# Altium schematic sheet DynamicComplexModulo_v1i1.SchDoc
size A3
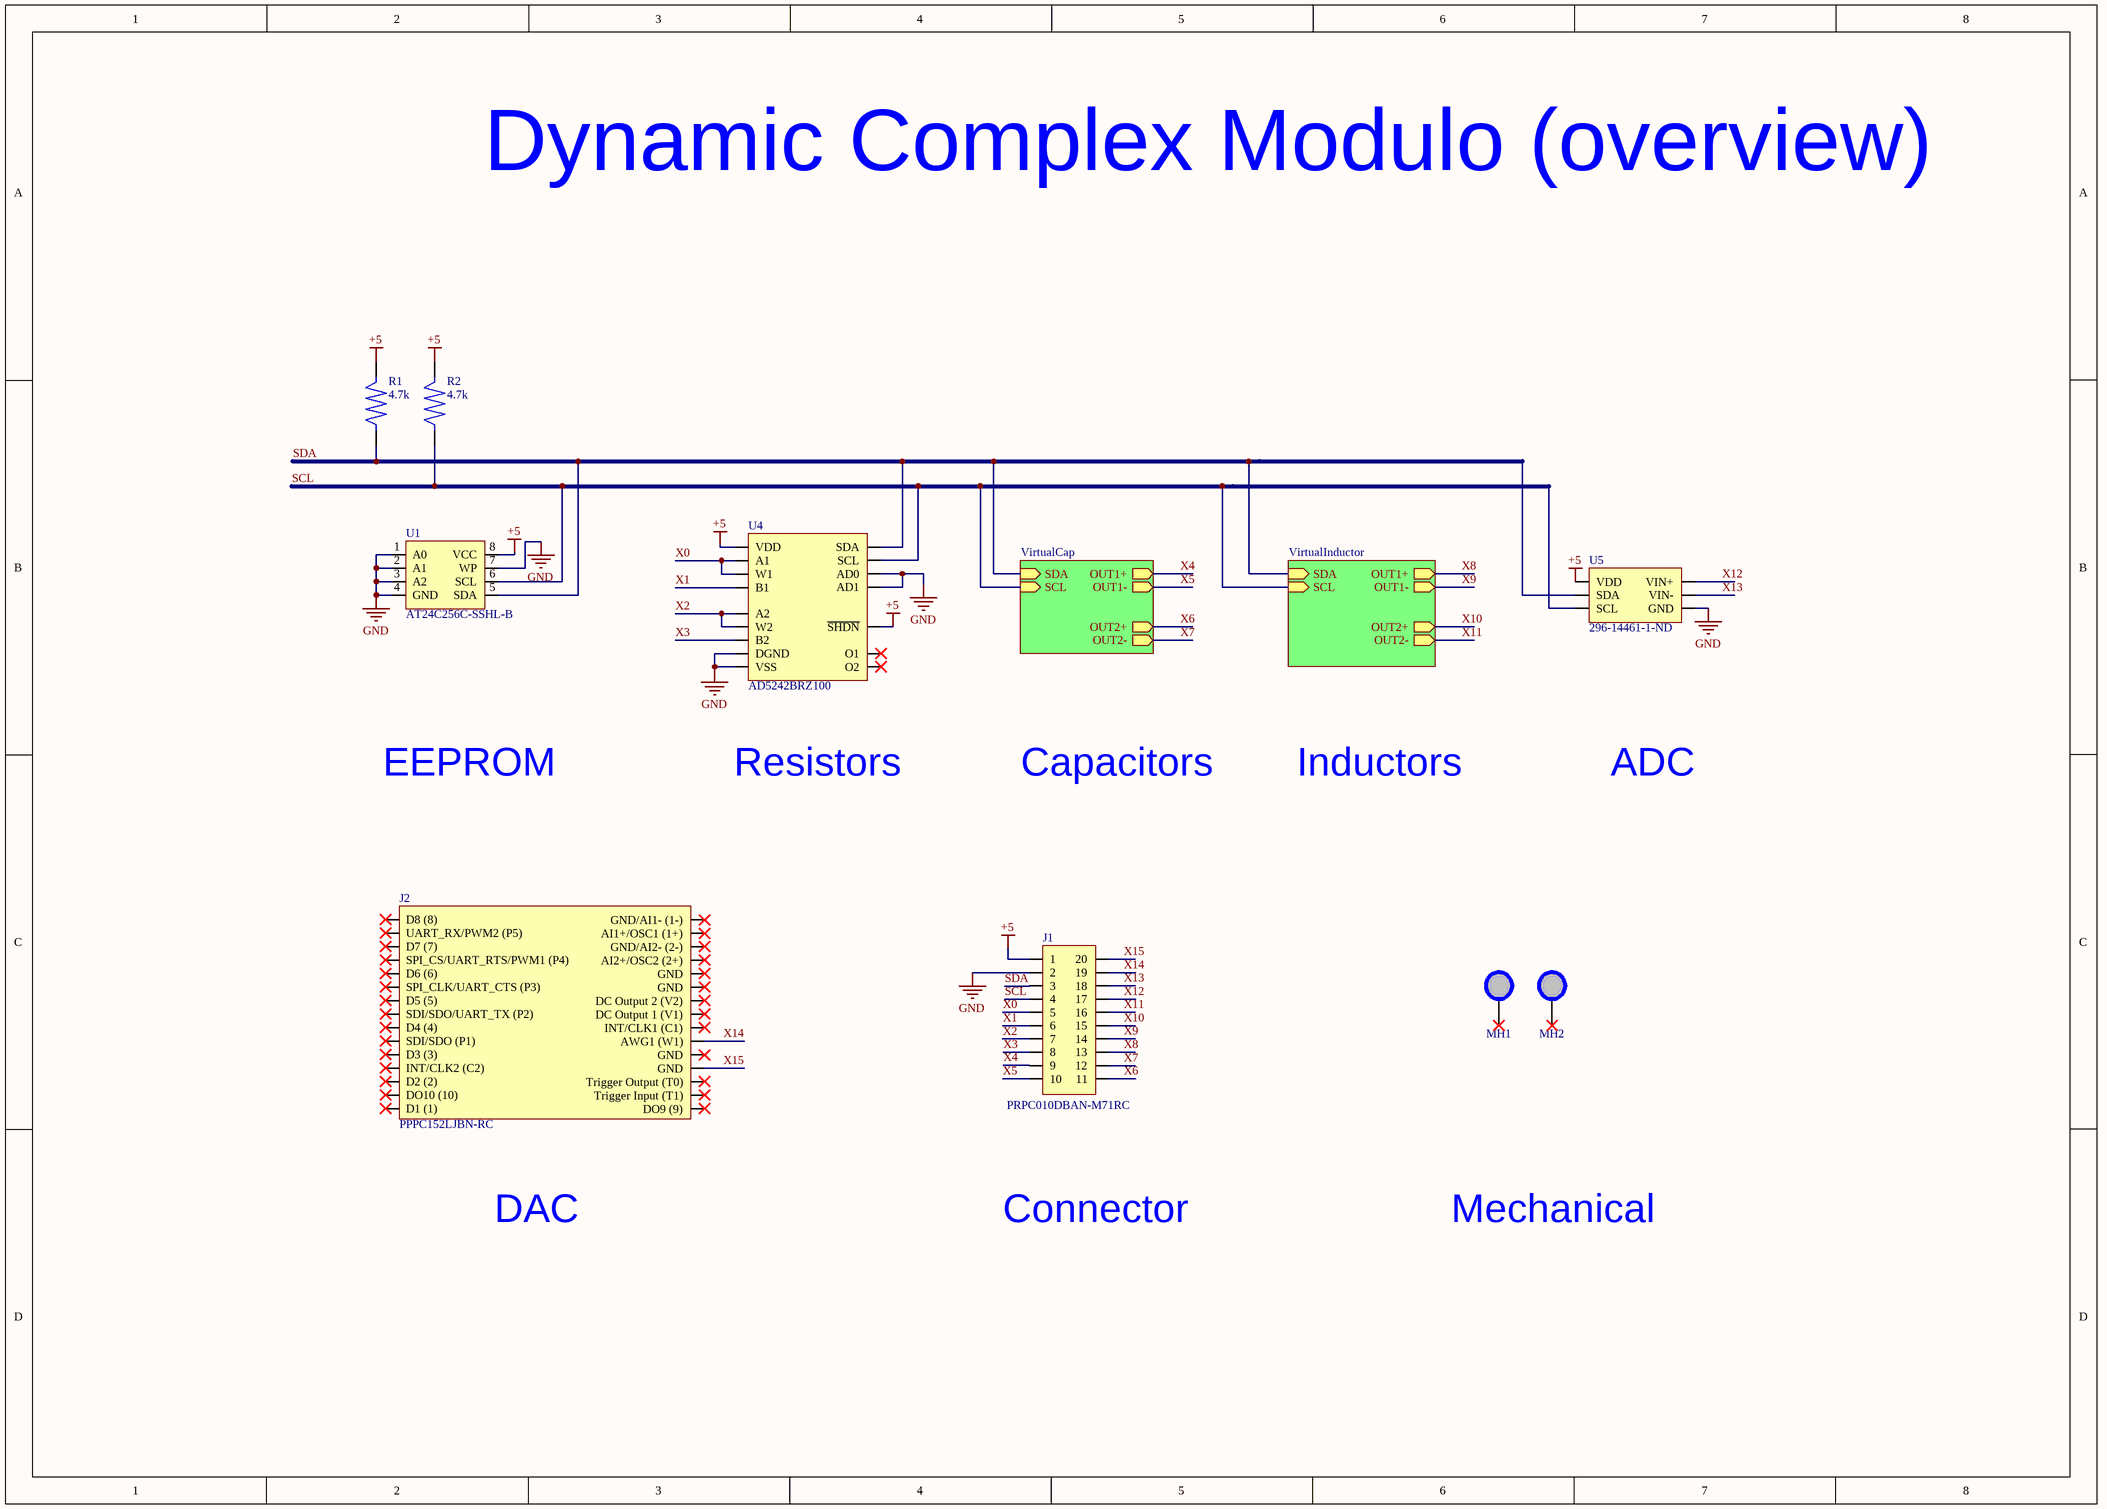
[diagram p0: DynamicComplexModulo_v1i1.SchDoc]

## Parts
J1  PRPC010DBAN-M71RC  [HDR_MALE_10x2x2.54]
J2  PPPC152LJBN-RC  [HDR_FEMALE_15x2x2.54]
MH1  MH 3.2mm NP  [MH3.2mm]  (value not drawn)  (no BOM)
MH2  MH 3.2mm NP  [MH3.2mm]  (value not drawn)  (no BOM)
R1  4.7k  [R0805]
R2  4.7k  [R0805]
U1  AT24C256C-SSHL-B  [AT24C256C-SSHL-B]
U4  AD5242BRZ100  [AD5242BRZ100]
U5  296-14461-1-ND  [SOT23-6]

## Sub-sheets
VirtualCap = CapacitorLadder.SchDoc: OUT1+ (out), OUT1- (out), OUT2+ (out), OUT2- (out), SDA (in), SCL (in)
VirtualInductor = InductorLadder.SchDoc: OUT1+ (out), OUT1- (out), OUT2+ (out), SDA (in), SCL (in), OUT2- (out)

## Nets
+5: J1.1 R1.2 R2.2 U1.8(VCC) U4.5(VDD) U4.6(~{SHDN}) U5.5(VDD)
GND: J1.2 U1.1(A0) U1.2(A1) U1.3(A2) U1.4(GND) U1.7(WP) U4.9(AD0) U4.10(AD1) U4.11(DGND) U4.12(VSS) U5.2(GND)
SCL: J1.4 R2.1 U1.6(SCL) U4.7(SCL) U5.3(SCL) ; sheet VirtualCap/SCL, sheet VirtualInductor/SCL
SDA: J1.3 R1.1 U1.5(SDA) U4.8(SDA) U5.4(SDA) ; sheet VirtualCap/SDA, sheet VirtualInductor/SDA
X0: J1.5 U4.2(A1) U4.3(W1)
X1: J1.6 U4.4(B1)
X2: J1.7 U4.15(W2) U4.16(A2)
X3: J1.8 U4.14(B2)
X4: J1.9 ; sheet VirtualCap/OUT1+
X5: J1.10 ; sheet VirtualCap/OUT1-
X6: J1.11 ; sheet VirtualCap/OUT2+
X7: J1.12 ; sheet VirtualCap/OUT2-
X8: J1.13 ; sheet VirtualInductor/OUT1+
X9: J1.14 ; sheet VirtualInductor/OUT1-
X10: J1.15 ; sheet VirtualInductor/OUT2+
X11: J1.16 ; sheet VirtualInductor/OUT2-
X12: J1.17 U5.1(VIN+)
X13: J1.18 U5.6(VIN-)
X14: J1.19 J2.21(AWG1_(W1))
X15: J1.20 J2.19(GND)

Not connected (* = marked no-connect by the designer): J2 1(D8_(8))* 2(UART_RX/PWM2_(P5))* 3(D7_(7))* 4(SPI_CS/UART_RTS/PWM1_(P4))* 5(D6_(6))* 6(SPI_CLK/UART_CTS_(P3))* 7(D5_(5))* 8(SDI/SDO/UART_TX_(P2))* 9(D4_(4))* 10(SDI/SDO_(P1))* 11(D3_(3))* 12(INT/CLK2_(C2))* 13(D2_(2))* 14(DO10_(10))* 15(D1_(1))* 16(DO9_(9))* 17(Trigger_Input_(T1))* 18(Trigger_Output_(T0))* 20(GND)* 22(INT/CLK1_(C1))* 23(DC_Output_1_(V1))* 24(DC_Output_2_(V2))* 25(GND)* 26(GND)* 27(AI2+/OSC2_(2+))* 28(GND/AI2-_(2-))* 29(AI1+/OSC1_(1+))* 30(GND/AI1-_(1-))*; MH1 1*; MH2 1*; U4 1(O1)* 13(O2)*

## Notes on the sheet
- Dynamic Complex Modulo (overview)
- EEPROM
- Resistors
- Capacitors
- Inductors
- ADC
- DAC
- Connector
- Mechanical

## Library data of the parts
J1 = HDR Male 2x10_2.54: 20 Positions Header, Unshrouded, Breakaway Connector 0.100" (2.54mm) Through Hole, Right Angle Gold; Manufacturer: Sullins; Number of Positions: 20; Connector Type: Male Pin; Pitch: 0.1inch; Supplier 1: Digi-Key; Manufacturer Part Number: PRPC010DBAN-M71RC; Stock 1: 459; Mount: Through Hole; Colour: Black; Contact Plating: Gold; Package Quantity: 1; Number of Rows: 2; Packaging: Bulk; Termination: Solder; Row Spacing: 0.1inch; Contact Mating Length: 0.23inch; ComponentLink1URL: https://datasheet.ciiva.com/741/xrxczzzdxxn-m71rc-11639-b-741675.pdf; ComponentLink1Description: https://datasheet.ciiva.com/741/xrxczzzdxxn-m71rc-11639-b-741675.pdf; Supplier Part Number 1: S2111EC-10-ND; Pricing 1: 1=1.08, 10=0.97, 100=0.7989, 500=0.6315, 1000=0.5421, 5000=0.49455, 10000=0.47553 (USD); System: Connector
J2 = OPENSCOPE_CONNECTOR: CONN FMALE 30POS DL .1" R/A GOLD; Manufacturer: Sullins; Number of Positions: 30; Connector Type: Socket,Header; Pitch: 0.1inch; Supplier 1: Digi-Key; Manufacturer Part Number: PPPC152LJBN-RC; Stock 1: 2029; Mount: Through Hole; Colour: Black; Contact Plating: Gold; Contact Material: Bronze; Housing Colour: Black; Housing Material: Plastic; Package Quantity: 1000; Number of Rows: 2; Packaging: Bulk; Termination: Solder; Length: 38.6mm; Height: 5mm; Row Spacing: 0.1inch; Width: 8.5mm; Lead Free: Lead Free; ComponentLink1URL: http://sullinscorp.com/drawings/101_P(N)PxCxx2LJBN-RC,_10494-H.pdf; ComponentLink1Description: http://sullinscorp.com/drawings/101_P(N)PxCxx2LJBN-RC,_10494-H.pdf; Supplier Part Number 1: S5568-ND; Pricing 1: 1=2.22, 10=2.018, 100=1.7294, 500=1.44112, 1000=1.23525, 5000=1.1895 (USD)
MH1 MH2 = MHNP: Mounting hole 3.2mm non plated
R1 R2 = R0805_4.7k
U1 = AT24C256C-SSHL-B: ATMEL         AT24C256C-SSHL-B            EEPROM, 256 Kbit, 32K x 8bit, 1 MHz, Serial, SOIC, 8 Pins; Manufacturer: Microchip / Atmel; Interface: I2C,Serial,2-Wire; Min Supply Voltage: 1.7V; Max Supply Voltage: 5.5V; Access Time: 550ns; Number of Words: 32768; Density: 256Kb; Frequency: 1MHz; Nominal Supply Current: 3mA; Voltage: 5V; Supplier 1: Digi-Key; Manufacturer Part Number: AT24C256C-SSHL-B; Stock 1: 4655; Mount: Surface Mount; Case/Package: SOIC; Number of Pins: 8; Contact Plating: Tin,Matte; Min Operating Temperature: -40°C; Max Operating Temperature: 85°C; Packaging: Bulk; Package Quantity: 100; Memory Type: EEPROM; Memory Size: 256Kb; Max Frequency: 1MHz; Length: 5.05mm; Height: 1.5mm; Width: 3.99mm; Radiation Hardening: No; REACH SVHC: No SVHC; ComponentLink1URL: https://datasheet.ciiva.com/15123/getdatasheetpartid-367456-15123424.pdf; ComponentLink1Description: https://datasheet.ciiva.com/15123/getdatasheetpartid-367456-15123424.pdf; ComponentLink2URL: https://datasheet.ciiva.com/15123/getdatasheetpartid-304516-15123348.pdf; ComponentLink2Description: https://datasheet.ciiva.com/15123/getdatasheetpartid-304516-15123348.pdf; ComponentLink3URL: https://datasheet.ciiva.com/1910/atmel-8568-seeprom-at24c256c-datasheet-1910422.pdf; ComponentLink3Description: https://datasheet.ciiva.com/1910/atmel-8568-seeprom-at24c256c-datasheet-1910422.pdf; ComponentLink4URL: https://datasheet.ciiva.com/1509/1726561-1509879.pdf; ComponentLink4Description: https://datasheet.ciiva.com/1509/1726561-1509879.pdf; Supplier Part Number 1: AT24C256C-SSHL-B-ND; Pricing 1: 1=0.68, 10=0.619, 25=0.6108, 100=0.543 (USD)
U4 = AD5242BRZ100-REEL7: IC POT DGTL DUAL 256POS 16SOIC; Manufacturer: Analog Devices; Resistance: 100kR; Interface: I2C; Max Supply Voltage: 5.5V; Min Supply Voltage: 2.7V; Min Dual Supply Voltage: 2.3V; Tolerance: 50%; Nominal Supply Current: 100nA; Dual Supply Voltage: 2.5V; Number of Circuits: 2; Number of Taps: 256; Memory Type: Volatile; Temperature Coefficient: 30ppm/°C; Frequency: 400kHz; -3db Bandwidth: 650kHz; Supplier 1: Digi-Key; Manufacturer Part Number: AD5242BRZ100-REEL7; Stock 1: 881; Mount: Surface Mount; Case/Package: SOIC; Number of Pins: 16; Contact Plating: Tin,Matte; Min Operating Temperature: -40°C; Max Operating Temperature: 105°C; Packaging: Tape and Reel; Max Dual Supply Voltage: 2.7V; Package Quantity: 1000; Taper: Linear; Operating Supply Current: 100nA; Number of Positions: 256; Number of Elements: 2; Max Supply Current: 100nA; Quiescent Current: 100nA; Lead Free: Contains Lead; ComponentLink1URL: https://datasheet.ciiva.com/3046/ad5241-5242-3046354.pdf; ComponentLink1Description: https://datasheet.ciiva.com/3046/ad5241-5242-3046354.pdf; ComponentLink2URL: https://datasheet.ciiva.com/1339/ad5241-5242-1339036.pdf; ComponentLink2Description: https://datasheet.ciiva.com/1339/ad5241-5242-1339036.pdf
U5 = ADS1110A7IDBVT: IC ADC 16-BIT I2C PROGBL SOT23-6; Manufacturer: Texas Instruments; Min Supply Voltage: 2.7V; Max Supply Voltage: 5.5V; Number of Channels: 1; Max Power Dissipation: 1.75mW; Operating Supply Voltage: 5V; Number of Bits: 16; Sampling Rate: 0.128KS/s; Resolution: 16b; Polarity: Bipolar,Unipolar; Differential Nonlinearity: 1LSB; Conversion Rate: 128S/s; Nominal Supply Current: 240uA; Supply Type: Single; Supplier 1: Digi-Key; Manufacturer Part Number: ADS1110A7IDBVT; Stock 1: 469; Case/Package: SOT-23-6; Number of Pins: 6; Contact Plating: Gold; Min Operating Temperature: -40°C; Max Operating Temperature: 125°C; Packaging: Tape and Reel; Package Quantity: 250; Interface: I2C; Number of Inputs: 1; Number of A/D Converters: 1; Number of Converters: 1; Number of Elements: 1; Power Dissipation: 1.75mW; Number of Analog Inputs: 1; Radiation Hardening: No; Lead Free: Lead Free; ComponentLink1URL: https://datasheet.ciiva.com/25993/ads1110-25993414.pdf; ComponentLink1Description: https://datasheet.ciiva.com/25993/ads1110-25993414.pdf; ComponentLink2URL: https://datasheet.ciiva.com/1262/ads1110-1262313.pdf; ComponentLink2Description: https://datasheet.ciiva.com/1262/ads1110-1262313.pdf; ComponentLink3URL: https://datasheet.ciiva.com/1262/ads1110-1262314.pdf; ComponentLink3Description: https://datasheet.ciiva.com/1262/ads1110-1262314.pdf; ComponentLink4URL: https://datasheet.ciiva.com/1262/ads1110-1262315.pdf; ComponentLink4Description: https://datasheet.ciiva.com/1262/ads1110-1262315.pdf; ComponentLink5URL: https://datasheet.ciiva.com/14260/sbas276a-14260046.pdf; ComponentLink5Description: https://datasheet.ciiva.com/14260/sbas276a-14260046.pdf; ComponentLink6URL: https://datasheet.ciiva.com/26800/ads1110a7idbvt-26800806.pdf; ComponentLink6Description: https://datasheet.ciiva.com/26800/ads1110a7idbvt-26800806.pdf; ComponentLink7URL: https://datasheet.ciiva.com/41461/001186690-da-01-en-ic-adc-16-bi-ads1110a7idbvt-sot-23-6-tid-41461014.pdf; ComponentLink7Description: https://datasheet.ciiva.com/41461/001186690-da-01-en-ic-adc-16-bi-ads1110a7idbvt-sot-23-6-tid-41461014.pdf; Supplier Part Number 1: 296-14468-6-ND; Pricing 1: 1=6.46, 10=5.805, 100=4.7561 (USD); Mount: Surface Mount